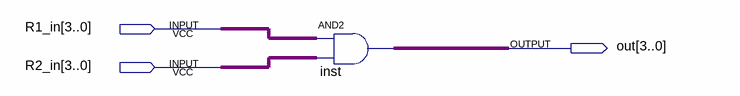
[diagram p0: schematic sheet]
// Quartus schematic And_Operator.bdf as structural Verilog: 1 symbols, 3 pins
module And_Operator (
  input  [3:0] R1_in,
  input  [3:0] R2_in,
  output [3:0] out
);

  assign out = R1_in & R2_in;  // AND2 inst, 4 bits wide
endmodule
